# Altium schematic sheet avr.SchDoc
size A2
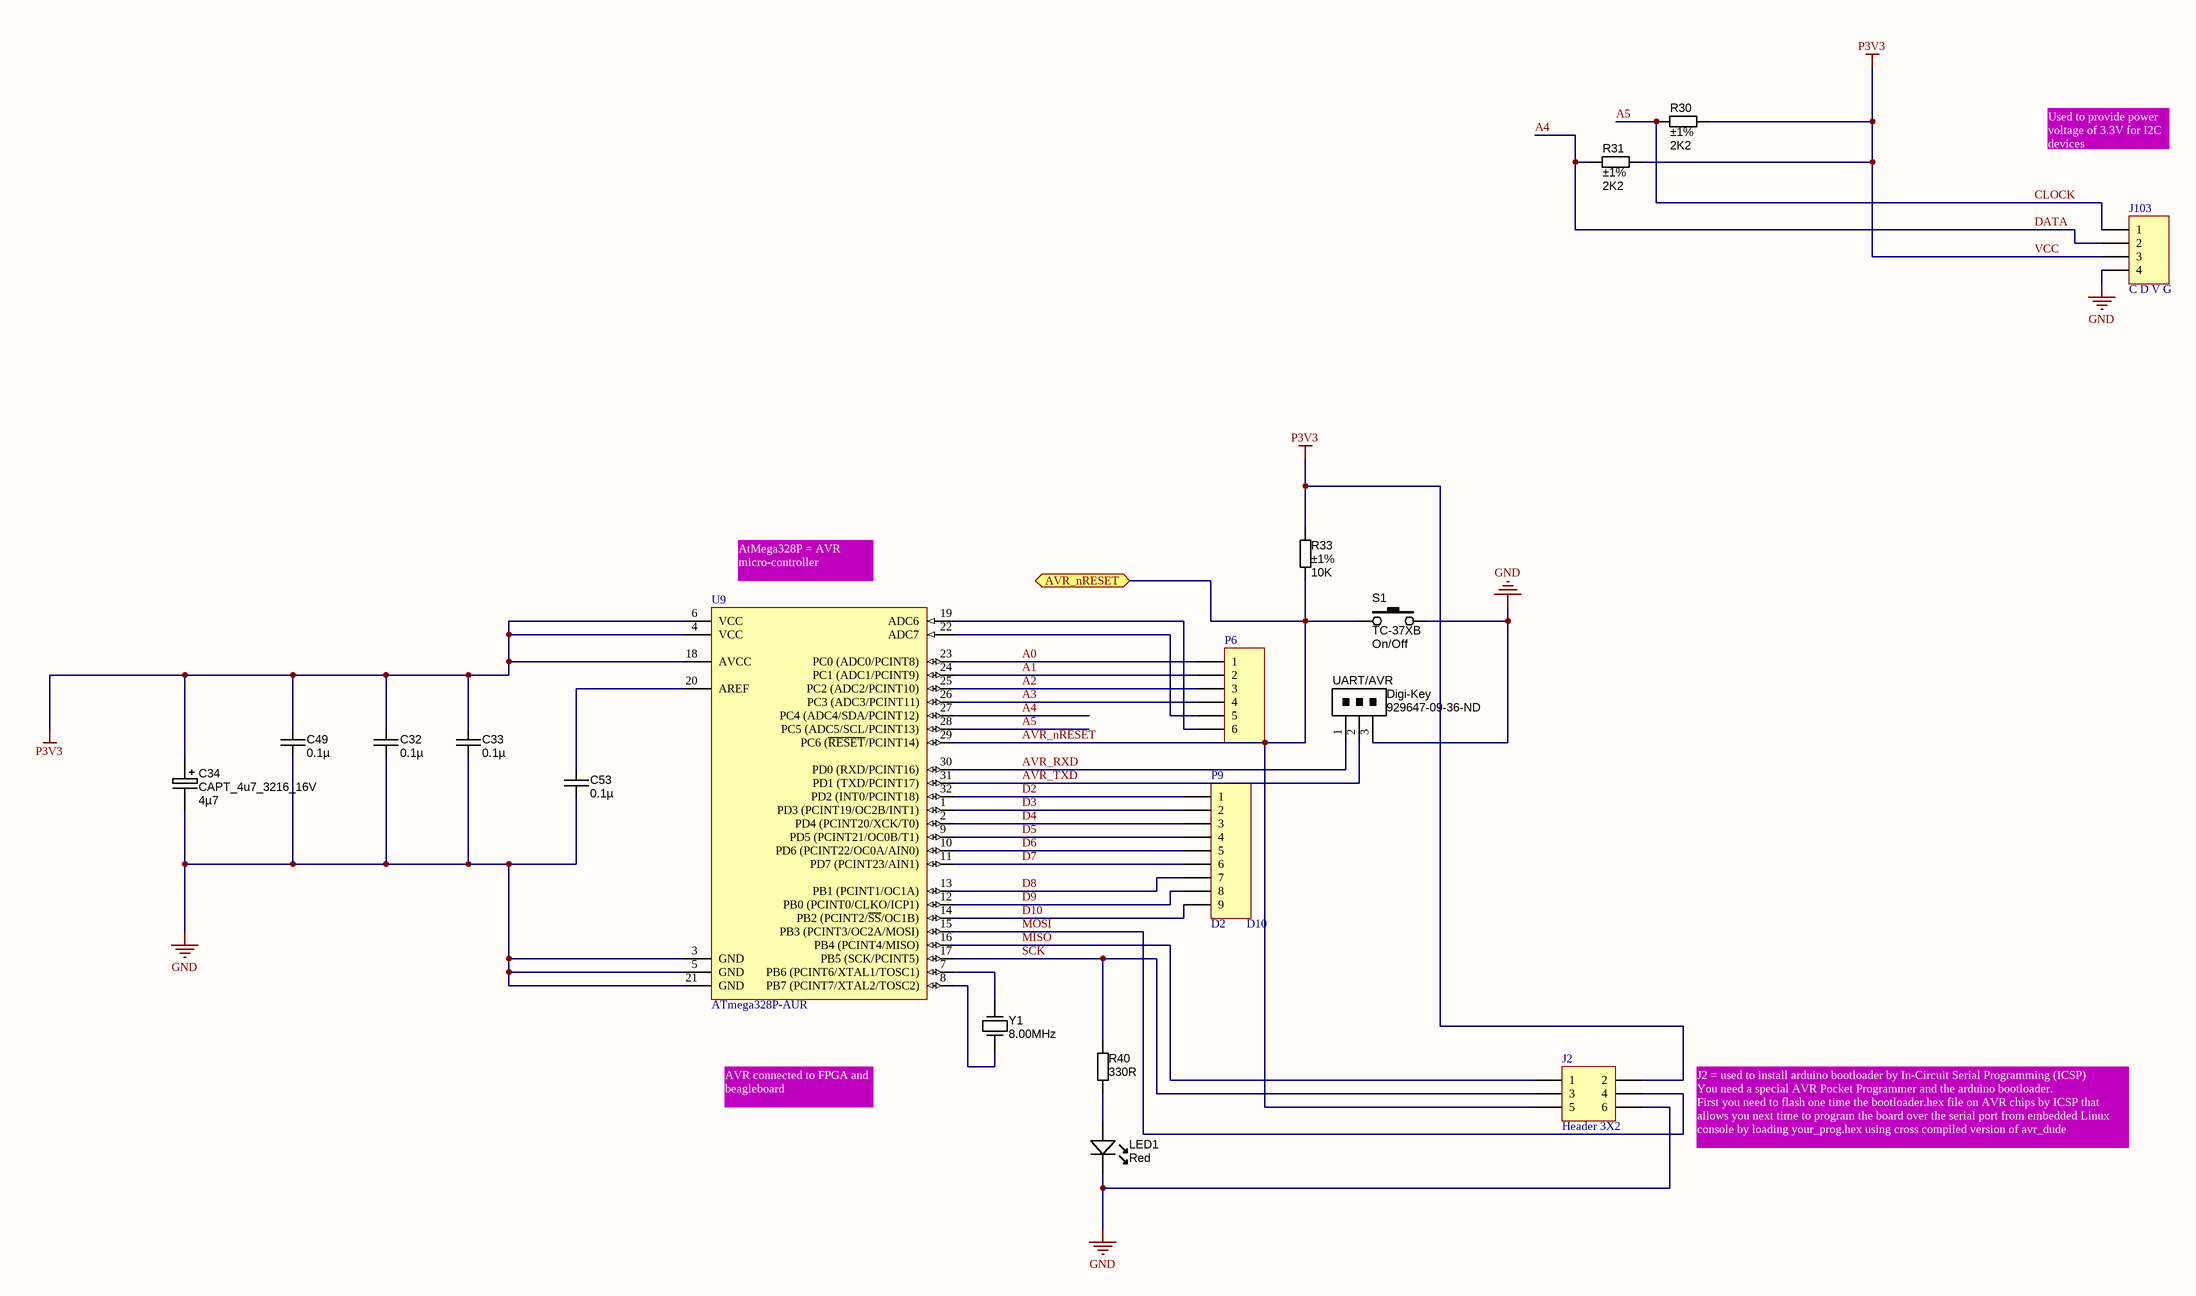
[diagram p0: avr.SchDoc]

## Parts
C32  0.1µ  [CAPC1005X55N]
C33  0.1µ  [CAPC1005X55N]
C34  CAPT_4u7_3216_16V  value 4µ7  [CAPMP3216X180N]
C49  0.1µ  [CAPC1005X55N]
C53  0.1µ  [CAPC1005X55N]
J2  Header 3X2  [HDR2X3]
J103  C D V G  [HDR1X4]
LED1  Color: Red  [LED-0603-RED]
P6  (no value)  [HDR1X6]
P9  D2       D10  [HDR1X9]
R30  value 2K2  Tolerance: ±1%  [RESC1005N]  (hidden comment: Thick Film)
R31  value 2K2  Tolerance: ±1%  [RESC1005N]  (hidden comment: Thick Film)
R33  value 10K  Tolerance: ±1%  [RESC1005X40N]  (hidden comment: Thick Film)
R40  value 330R  [RESC1005X40N]  (hidden comment: Thick Film)
S1  Manufacturer Part Number 1: TC-37XB  Function: On/Off  [TACT-SWITCH-TS1143]  (hidden comment: SW_THT_PB_5.0mm)
U9  ATmega328P-AUR  [32A_N]
UART/AVR  Supplier 1: Digi-Key  Supplier Part Number 1: 929647-09-36-ND  [1x3POS_HEADER]  (hidden comment: R T G)
Y1  8.00MHz  [CRYSTAL_HC49-US-SM]

## Ports
AVR_nRESET (bidir)

## Nets
GND: C32.2 C33.2 C34.2 C49.2 C53.2 J2.6 J103.4 LED1.K S1.2 U9.3(GND) U9.5(GND) U9.21(GND) UART/AVR.3
VCC: C32.1 C33.1 C34.1 C49.1 J2.2 J103.3 R30.2 R31.2 R33.1 U9.4(VCC) U9.6(VCC) U9.18(AVCC)  [also labelled P3V3]
A0: P6.1 U9.23(PC0_(ADC0/PCINT8))
A1: P6.2 U9.24(PC1_(ADC1/PCINT9))
A2: P6.3 U9.25(PC2_(ADC2/PCINT10))
A3: P6.4 U9.26(PC3_(ADC3/PCINT11))
A4: J103.2 R31.1 U9.27(PC4_(ADC4/SDA/PCINT12))  [also labelled DATA]
A5: J103.1 R30.1 U9.28(PC5_(ADC5/SCL/PCINT13))  [also labelled CLOCK]
AVR_nRESET: J2.5 R33.2 S1.1 U9.29(PC6_(~{RESET}/PCINT14)) ; port AVR_nRESET
AVR_RXD: U9.30(PD0_(RXD/PCINT16)) UART/AVR.1
AVR_TXD: U9.31(PD1_(TXD/PCINT17)) UART/AVR.2
D2: P9.1 U9.32(PD2_(INT0/PCINT18))
D3: P9.2 U9.1(PD3_(PCINT19/OC2B/INT1))
D4: P9.3 U9.2(PD4_(PCINT20/XCK/T0))
D5: P9.4 U9.9(PD5_(PCINT21/OC0B/T1))
D6: P9.5 U9.10(PD6_(PCINT22/OC0A/AIN0))
D7: P9.6 U9.11(PD7_(PCINT23/AIN1))
D8: P9.7 U9.13(PB1_(PCINT1/OC1A))
D9: P9.8 U9.12(PB0_(PCINT0/CLKO/ICP1))
D10: P9.9 U9.14(PB2_(PCINT2/~{SS}/OC1B))
MISO: J2.1 U9.16(PB4_(PCINT4/MISO))
MOSI: J2.4 U9.15(PB3_(PCINT3/OC2A/MOSI))
SCK: J2.3 R40.1 U9.17(PB5_(SCK/PCINT5))
NetC53_1: C53.1 U9.20(AREF)
NetLED1_A: LED1.A R40.2
NetP6_5: P6.5 U9.22(ADC7)
NetP6_6: P6.6 U9.19(ADC6)
NetU9_7: U9.7(PB6_(PCINT6/XTAL1/TOSC1)) Y1.2(OUT)
NetU9_8: U9.8(PB7_(PCINT7/XTAL2/TOSC2)) Y1.1(IN)

## Notes on the sheet
- Used to provide power voltage of 3.3V for I2C devices
- (near U9) AtMega328P = AVR micro-controller
- AVR connected to FPGA and beagleboard
- J2 = used to install arduino bootloader by In-Circuit Serial Programming (ICSP)
  You need a special AVR Pocket Programmer and the arduino bootloader.
  First you need to flash one time the bootloader.hex file on AVR chips by ICSP that
  allows you next time to program the board over the serial port from embedded Linux
  console by loading your_prog.hex using cross compiled version of avr_dude

## Library data of the parts
C32 C33 C49 C53 = CAPC_1u_0402_X5R_6V3_10%: Capacitor SMD Cer 1uF 10% 16V X5R 0402; Manufacturer 1: AVX Corporation; Manufacturer Part Number 1: 04026D105KAT2A; Ratings: 6.3V; X5R; SCDType: spec; Value: 0.1µ; Tolerance: ±10%; Operating Temperature: -55°C ~ 125°C; Package / Case: 0402 (1005 Metric); Size / Dimension: 0.039" L x 0.020" W (1.00mm x 0.50mm); Supplier 1: Digi-Key; Supplier Part Number 1: 478-2583-1-ND; RoHS 1: RoHS Compliant; ComponentLink1URL: http://www.avx.com/docs/Catalogs/cx5r.pdf; ComponentLink1Description: http://www.avx.com/docs/Catalogs/cx5r.pdf; Supplier 2: Digi-Key; Supplier Part Number 2: 311-1438-1-ND; Manufacturer 2: Yageo; Manufacturer Part Number 2: CC0402KRX5R5BB105; RoHS 2: RoHS Compliant; ComponentLink2URL: http://www.yageo.com/documents/recent/UPY-GPHC_X5R_4V-to-50V_12.pdf; ComponentLink2Description: http://www.yageo.com/documents/recent/UPY-GPHC_X5R_4V-to-50V_12.pdf; Supplier 3: Digi-Key; Supplier Part Number 3: 1276-1010-1-ND; Manufacturer 3: Samsung Electro-Mechanics America, Inc; Manufacturer Part Number 3: CL05A105KQ5NNNC; RoHS 3: RoHS Compliant; ComponentLink3URL: http://www.samsungsem.com/servlet/FileDownload?path=productsearch&sname=CL05A105KQ5NNNC.pdf&oname=CL05A105KQ5NNNC.pdf; ComponentLink3Description: http://www.samsungsem.com/servlet/FileDownload?path=productsearch&sname=CL05A105KQ5NNNC.pdf&oname=CL05A105KQ5NNNC.pdf; Supplier 4: Digi-Key; Supplier Part Number 4: 445-4998-1-ND; Manufacturer 4: TDK Corporation; Manufacturer Part Number 4: C1005X5R0J105K050BB; RoHS 4: RoHS Compliant; ComponentLink4URL: http://product.tdk.com/capacitor/mlcc/en/documents/mlcc_commercial_general_en.pdf; ComponentLink4Description: http://product.tdk.com/capacitor/mlcc/en/documents/mlcc_commercial_general_en.pdf; Supplier 5: Digi-Key; Supplier Part Number 5: 490-1320-1-ND; Manufacturer 5: Murata Electronics North America; Manufacturer Part Number 5: GRM155R60J105KE19D; RoHS 5: RoHS Compliant; ComponentLink5URL: http://www.murata.com/products/catalog/pdf/c02e.pdf; ComponentLink5Description: http://www.murata.com/products/catalog/pdf/c02e.pdf
C34 = CAPT_4u7_3216_16V: Capacitor SMD Tantalum 4.7uF 10% 16V 3216-18; Manufacturer 1: Vishay/Sprague; Manufacturer Part Number 1: 293D475X9016A2TE3; SCDType: undef; Package / Case: EIA 535BAAC size A; Ratings: 16V; Tolerance: ±10%; Material: Tantalum; Supplier 1: Digi-Key; Supplier Part Number 1: 718-1148-1-ND
J2 = Header 3X2: Header, 3-Pin, Dual row; LatestRevisionDate: 17-Jul-2002; LatestRevisionNote: Re-released for DXP Platform.; Publisher: Altium Limited
J103 = Header 4: Header, 4-Pin; LatestRevisionDate: 17-Jul-2002; LatestRevisionNote: Re-released for DXP Platform.; Publisher: Altium Limited
LED1 = LED_SMD_Red_0805_6mcd: LED 0805 SMD Red 6mcd 621nm; Manufacturer 1: Lite-On Inc; Manufacturer Part Number 1: LTST-C171EKT; Material: GaAsP on GaP; Ratings: 6 mcd; 621 nm; SCDType: source; Package / Case: 0805; Supplier 1: Digi-Key; Supplier Part Number 1: 160-1422-1-ND; Value: Red
P6 = Header 6: Header, 6-Pin; LatestRevisionDate: 17-Jul-2002; LatestRevisionNote: Re-released for DXP Platform.; Publisher: Altium Limited
P9 = Header 9: Header, 9-Pin; LatestRevisionDate: 17-Jul-2002; LatestRevisionNote: Re-released for DXP Platform.; Publisher: Altium Limited
R30 R31 = RES_2K2_0805_1%: Resistor SMD chip 2.2k Ohm 0.125W 1% 0805; Manufacturer 1: Vishay/Dale; Manufacturer Part Number 1: CRCW08052K20FKEA; Ratings: 1/8W; SCDType: spec; Supplier 1: Digi-Key; Supplier Part Number 1: 541-2.20KCCT-ND; Package / Case: 0805 (2012 metric)
R33 = RES_10K_0402_1%: Resistor SMD chip 10k Ohm 0.063W 1% 0402; Manufacturer 1: Vishay Dale; Manufacturer Part Number 1: CRCW040210K0FKED; Ratings: 1/16 W; SCDType: spec; Package / Case: 0402 (1005 Metric); Manufacturer 2: Yageo; Manufacturer Part Number 2: RC0402FR-0710KL; Supplier 1: Digi-Key; Supplier Part Number 1: 541-10.0KLCT-ND; ComponentLink1URL: http://www.vishay.com/doc?20035; ComponentLink1Description: http://www.vishay.com/doc?20035; Supplier 2: Digi-Key; Supplier Part Number 2: 311-10.0KLRCT-ND; ComponentLink2URL: http://www.yageo.com/documents/recent/PYu-RC0402_51_RoHS_L_6.pdf; ComponentLink2Description: http://www.yageo.com/documents/recent/PYu-RC0402_51_RoHS_L_6.pdf
R40 = RES_330R_0402_5%: Resistor SMD chip 330 Ohm 0.063W 5% 0402; Manufacturer 1: Yageo; Manufacturer Part Number 1: RC0402JR-07330RL; Ratings: 1/16 W; SCDType: spec; Package / Case: 0402 (1005 Metric); Tolerance: ±5%; Supplier 1: Digi-Key; Supplier Part Number 1: 311-330JRCT-ND; ComponentLink1URL: http://www.yageo.com/documents/recent/PYu-RC0402_51_RoHS_L_6.pdf; ComponentLink1Description: http://www.yageo.com/documents/recent/PYu-RC0402_51_RoHS_L_6.pdf
S1 = SW_THT_PB_5.0mm: Switch, tact, 5.0mm stem; Manufacturer 1: Wealth Metal; SCDType: spec; Package / Case: 6.5x6.5mm; 5.0mm stem; Material: Brass/Nylon/Ag plating
U9 = ATmega328-AUR: 8-bit AVR Microcontroller, 32KB Flash, 1KB EEPROM, 2KB SRAM, 32-pin TQFP, Industrial Grade (-40°C to 85°C); Published: 1-Apr-2010; DatasheetVersion: revA, Jan-2010; PackageVersion: revB, Oct-2001; PackageReference: 32A; Publisher: Altium Limited; PackageDescription: 32-Lead, 7x7x1.0 mm Body, 0.8mm Lead Pitch, Thin Profile Plastic Quad Flat Package (TQFP); Supplier 1: Digi-Key; Supplier Part Number 1: ATMEGA328P-AUR-ND; Supplier 2: Mouser; Supplier Part Number 2: 556-ATMEGA328P-AUR; Code_JEDEC: MS-026-ABA; ComponentLink1Description: Manufacturer Link; ComponentLink1URL: http://www.atmel.com/products/avr/default.asp?; ComponentLink2Description: ATmega48A/48PA/88A/88PA/168A/168PA/328/328P Datasheet; ComponentLink2URL: http://www.atmel.com/dyn/resources/prod_documents/8271.pdf; ComponentLink3Description: ATmega48A/48PA/88A/88PA/168A/168PA/328/328P Summary; ComponentLink3URL: http://www.atmel.com/dyn/resources/prod_documents/8271S.pdf; ComponentLink4Description: Atmel.com Home; ComponentLink4URL: http://www.atmel.com
UART/AVR = CONN_HEADER_1x3P_0.100in: Pin Header, THT, Single-row, 2.54mm pitch; Manufacturer 1: 3M; Manufacturer Part Number 1: 929647-09-36-I; Pitch: 0.100" (2.54mm); Value: Single-row, 3 positions; QtyOverride: 0.1; SCDType: undef; Category: Connectors; Mounting Type: Through Hole; Terminal Block Type: Header, Male Pins, Single; Package / Case: Pin header; 2.54mm pitch
Y1 = Crystal_6MHz_HC49/US: Resonator Ceramic 8.00 MHz 30ppm; Manufacturer 1: CTS-Frequency Controls; Manufacturer Part Number 1: ATS080BSM-1; Frequency: 8MHz; Frequency Stability: ±50ppm; Load Capacitance: 18pF; Operating Mode: Fundamental; Parameter Name: 0.169" (4.30mm); Package / Case: HC49/US-SM; Ratings: 8.00 MHz; Supplier 1: Digi-Key; Type: 8 MHz Crystal; Frequency Tolerance: ±30ppm; Operating Temperature: -20°C ~ 70°C; Mounting Type: Surface Mount; Size / Dimension: 0.437" L x 0.190" W (11.10mm x 4.83mm); ComponentLink1URL: http://www.ctscorp.com/components/Datasheets/008-0309-0.pdf; ComponentLink1Description: http://www.ctscorp.com/components/Datasheets/008-0309-0.pdf